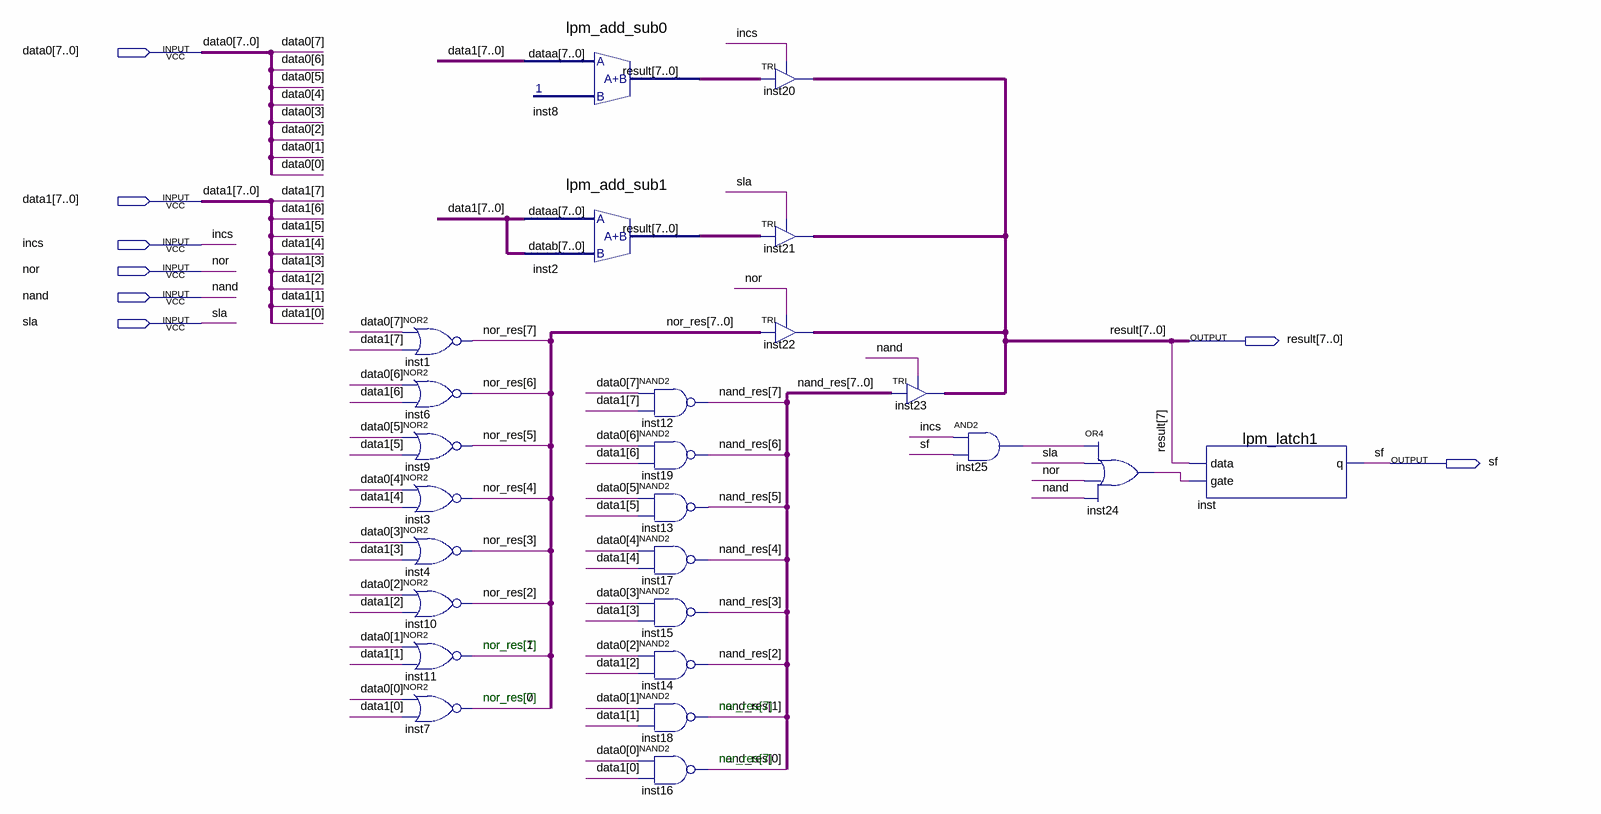
[diagram p0: schematic sheet]
// Quartus schematic ALU.bdf as structural Verilog: 25 symbols, 8 pins
module ALU (
  input  [7:0] data0,
  input  [7:0] data1,
  input  incs,
  input  \nor ,
  input  \nand ,
  input  sla,
  output [7:0] result,
  output sf
);

  wire inst24_out, inst25_out;
  wire [7:0] inst2_result, inst8_result, nand_res, nor_res;

  nor inst1 (nor_res[7], data0[7], data1[7]);
  nor inst6 (nor_res[6], data0[6], data1[6]);
  nor inst9 (nor_res[5], data0[5], data1[5]);
  nor inst3 (nor_res[4], data0[4], data1[4]);
  nor inst4 (nor_res[3], data0[3], data1[3]);
  nor inst10 (nor_res[2], data0[2], data1[2]);
  nor inst11 (nor_res[1], data0[1], data1[1]);
  nor inst7 (nor_res[0], data0[0], data1[0]);
  lpm_add_sub0 inst8 (.dataa(data1), .result(inst8_result));
  lpm_add_sub1 inst2 (.dataa(data1), .datab(data1), .result(inst2_result));
  nand inst12 (nand_res[7], data0[7], data1[7]);
  nand inst19 (nand_res[6], data0[6], data1[6]);
  nand inst13 (nand_res[5], data0[5], data1[5]);
  nand inst17 (nand_res[4], data0[4], data1[4]);
  nand inst15 (nand_res[3], data0[3], data1[3]);
  nand inst14 (nand_res[2], data0[2], data1[2]);
  nand inst18 (nand_res[1], data0[1], data1[1]);
  nand inst16 (nand_res[0], data0[0], data1[0]);
  TRI inst20[7:0] (.IN(inst8_result), .OE(incs), .OUT(result));
  TRI inst21[7:0] (.IN(inst2_result), .OE(sla), .OUT(result));
  TRI inst22[7:0] (.IN(nor_res), .OE(\nor ), .OUT(result));
  TRI inst23[7:0] (.IN(nand_res), .OE(\nand ), .OUT(result));
  and inst25 (inst25_out, incs, sf);
  or inst24 (inst24_out, inst25_out, sla, \nor , \nand );
  lpm_latch1 inst (.data(result[7]), .gate(inst24_out), .q(sf));

  // Notes on the sheet:
  //   nor_res[7]
  //   nor_res[7]
  //   nor_res[7]
  //   nor_res[7]
endmodule
